# Altium schematic sheet config-bank6.SchDoc: Config FPGA - Bank 6
size Letter; CheckedBy: E. Chiu; CompanyName: Brinton Engineering, LLC; DrawnBy: J. Brinton; Engineer: J. Brinton; Address1: 3479 Edison Way; Address2: Menlo Park CA 94025; Address3: +1 (877) 778-8435; Address4: brintonengineering.com; Revision: 1; SheetNumber: 23; SheetTotal: 71
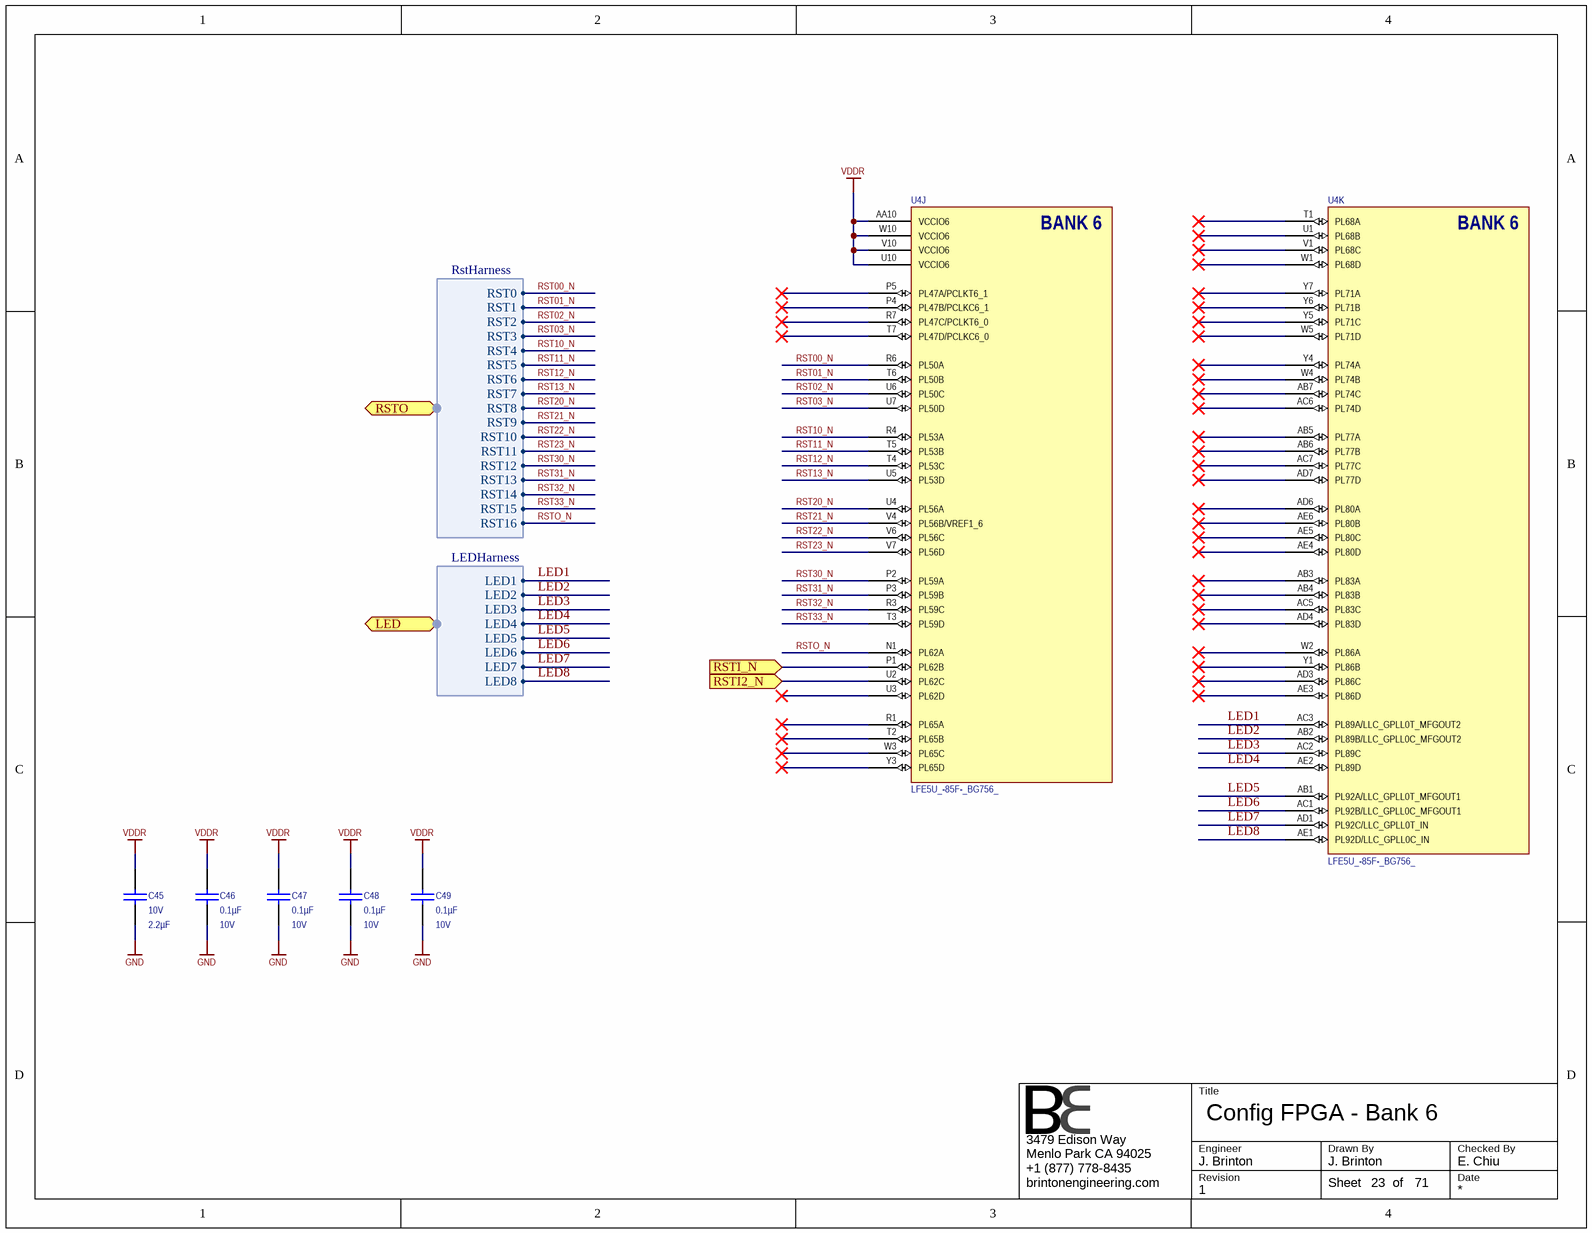
[diagram p0: config-bank6.SchDoc]

## Parts
C45  Voltage - Rated: 10V  Capacitance: 2.2µF  [CAPC1608X90N]  (hidden comment: GRM188R71A225KE15D)
C46  Capacitance: 0.1µF  Voltage - Rated: 10V  [CAPC1005X56N]  (hidden comment: GRM155R71A104KA01J)
C47  Capacitance: 0.1µF  Voltage - Rated: 10V  [CAPC1005X56N]  (hidden comment: GRM155R71A104KA01J)
C48  Capacitance: 0.1µF  Voltage - Rated: 10V  [CAPC1005X56N]  (hidden comment: GRM155R71A104KA01J)
C49  Capacitance: 0.1µF  Voltage - Rated: 10V  [CAPC1005X56N]  (hidden comment: GRM155R71A104KA01J)
U4  LFE5U_-85F-_BG756_  [caBGA756]  (parts J,K of 19)

## Ports
LED (harness LEDHarness), RSTI2_N (in), RSTI_N (in), RSTO (harness RstHarness)

## Harnesses
RstHarness: RST0, RST1, RST2, RST3, RST4, RST5, RST6, RST7, RST8, RST9, RST10, RST11, RST12, RST13, RST14, RST15, RST16
LEDHarness: LED1, LED2, LED3, LED4, LED5, LED6, LED7, LED8

## Nets
GND: C45.1 C46.1 C47.1 C48.1 C49.1
VDDR: C45.2 C46.2 C47.2 C48.2 C49.2 U4.AA10(VCCIO6) U4.U10(VCCIO6) U4.V10(VCCIO6) U4.W10(VCCIO6)
LED1: U4.AC3(PL89A/LLC_GPLL0T_MFGOUT2) ; port LED.LED1
LED2: U4.AB2(PL89B/LLC_GPLL0C_MFGOUT2) ; port LED.LED2
LED3: U4.AC2(PL89C) ; port LED.LED3
LED4: U4.AE2(PL89D) ; port LED.LED4
LED5: U4.AB1(PL92A/LLC_GPLL0T_MFGOUT1) ; port LED.LED5
LED6: U4.AC1(PL92B/LLC_GPLL0C_MFGOUT1) ; port LED.LED6
LED7: U4.AD1(PL92C/LLC_GPLL0T_IN) ; port LED.LED7
LED8: U4.AE1(PL92D/LLC_GPLL0C_IN) ; port LED.LED8
RST00_N: U4.R6(PL50A) ; port RSTO.RST0
RST01_N: U4.T6(PL50B) ; port RSTO.RST1
RST02_N: U4.U6(PL50C) ; port RSTO.RST2
RST03_N: U4.U7(PL50D) ; port RSTO.RST3
RST10_N: U4.R4(PL53A) ; port RSTO.RST4
RST11_N: U4.T5(PL53B) ; port RSTO.RST5
RST12_N: U4.T4(PL53C) ; port RSTO.RST6
RST13_N: U4.U5(PL53D) ; port RSTO.RST7
RST20_N: U4.U4(PL56A) ; port RSTO.RST8
RST21_N: U4.V4(PL56B/VREF1_6) ; port RSTO.RST9
RST22_N: U4.V6(PL56C) ; port RSTO.RST10
RST23_N: U4.V7(PL56D) ; port RSTO.RST11
RST30_N: U4.P2(PL59A) ; port RSTO.RST12
RST31_N: U4.P3(PL59B) ; port RSTO.RST13
RST32_N: U4.R3(PL59C) ; port RSTO.RST14
RST33_N: U4.T3(PL59D) ; port RSTO.RST15
RSTI2_N: U4.U2(PL62C) ; port RSTI2_N
RSTI_N: U4.P1(PL62B) ; port RSTI_N
RSTO_N: U4.N1(PL62A) ; port RSTO.RST16

Not connected (* = marked no-connect by the designer): U4 AB3(PL83A)* AB4(PL83B)* AB5(PL77A)* AB6(PL77B)* AB7(PL74C)* AC5(PL83C)* AC6(PL74D)* AC7(PL77C)* AD3(PL86C)* AD4(PL83D)* AD6(PL80A)* AD7(PL77D)* AE3(PL86D)* AE4(PL80D)* AE5(PL80C)* AE6(PL80B)* P4(PL47B/PCLKC6_1)* P5(PL47A/PCLKT6_1)* R1(PL65A)* R7(PL47C/PCLKT6_0)* T1(PL68A)* T2(PL65B)* T7(PL47D/PCLKC6_0)* U1(PL68B)* U3(PL62D)* V1(PL68C)* W1(PL68D)* W2(PL86A)* W3(PL65C)* W4(PL74B)* W5(PL71D)* Y1(PL86B)* Y3(PL65D)* Y4(PL74A)* Y5(PL71C)* Y6(PL71B)* Y7(PL71A)*

## Notes on the sheet
- Title
- Engineer
- Revision
- Drawn By
- Checked By
- Date
- Sheet
- of
- (in symbol LFE5U_-85F-_BG756_, part J) BANK 6
- (in symbol LFE5U_-85F-_BG756_, part K) BANK 6

## Library data of the parts
C45 = GRM188R71A225KE15D: CAP CER 2.2UF 10V 10% X7R 0603; Manufacturer: Murata Electronics North America; Manufacturer P/N: GRM188R71A225KE15D; Operating Temperature: -55°C ~ 125°C; Thickness (Max): 0.035" (0.90mm); Tolerance: ±10%; Package / Case: 0603 (1608 Metric); Temperature Coefficient: X7R; Supplier 1: Newark; Supplier 2: Digi-Key; RoHS: RoHS Compliant; Size / Dimension: 0.063" L x 0.031" W (1.60mm x 0.80mm); Mounting Type: Surface Mount, MLCC; ComponentLink1URL: http://www.murata.com/~/media/webrenewal/support/library/catalog/products/capacitor/mlcc/c02e.ashx; ComponentLink1Description: http://www.murata.com/~/media/webrenewal/support/library/catalog/products/capacitor/mlcc/c02e.ashx; Supplier Part Number 1: 72R4209; Supplier Part Number 2: 490-4520-1-ND
C46-C49 = GRM155R71A104KA01J: CAP CER 0.1UF 10V 10% X7R 0402; Manufacturer: Murata Electronics North America; Manufacturer P/N: GRM155R71A104KA01J; Operating Temperature: -55°C ~ 125°C; Thickness (Max): 0.022" (0.55mm); Size / Dimension: 0.039" L x 0.020" W (1.00mm x 0.50mm); RoHS: RoHS Compliant; Mounting Type: Surface Mount, MLCC; Supplier 1: Digi-Key; ComponentLink1URL: http://www.murata.com/~/media/webrenewal/support/library/catalog/products/capacitor/mlcc/c02e.ashx; ComponentLink1Description: http://www.murata.com/~/media/webrenewal/support/library/catalog/products/capacitor/mlcc/c02e.ashx; Supplier Part Number 1: 490-6322-1-ND; Temperature Coefficient: X7R; Package / Case: 0402 (1005 Metric); Tolerance: ±10%
U4 = LFE5U_-85F-_BG756_: ECP5 FPGA, 85k LUT, 756-caBGA; Manufacturer: Lattice Semiconductor; Manufacturer P/N: LFE5U_-85F-_BG756_